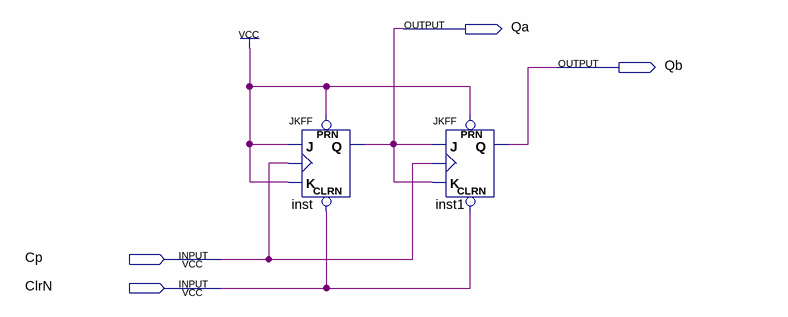
[diagram p0: schematic sheet]
// Quartus schematic 2bits_counter.bdf as structural Verilog: 2 symbols, 4 pins
module \2bits_counter  (
  input  Cp,
  input  ClrN,
  output Qa,
  output Qb
);

  JKFF inst (.PRN(1'b1), .CLRN(ClrN), .K(1'b1), .J(1'b1), .CLK(Cp), .Q(Qa));
  JKFF inst1 (.PRN(1'b1), .CLRN(ClrN), .K(Qa), .J(Qa), .CLK(Cp), .Q(Qb));
endmodule
